# Altium schematic sheet micron_ram.SchDoc
size A; SheetNumber: 1; SheetTotal: 11
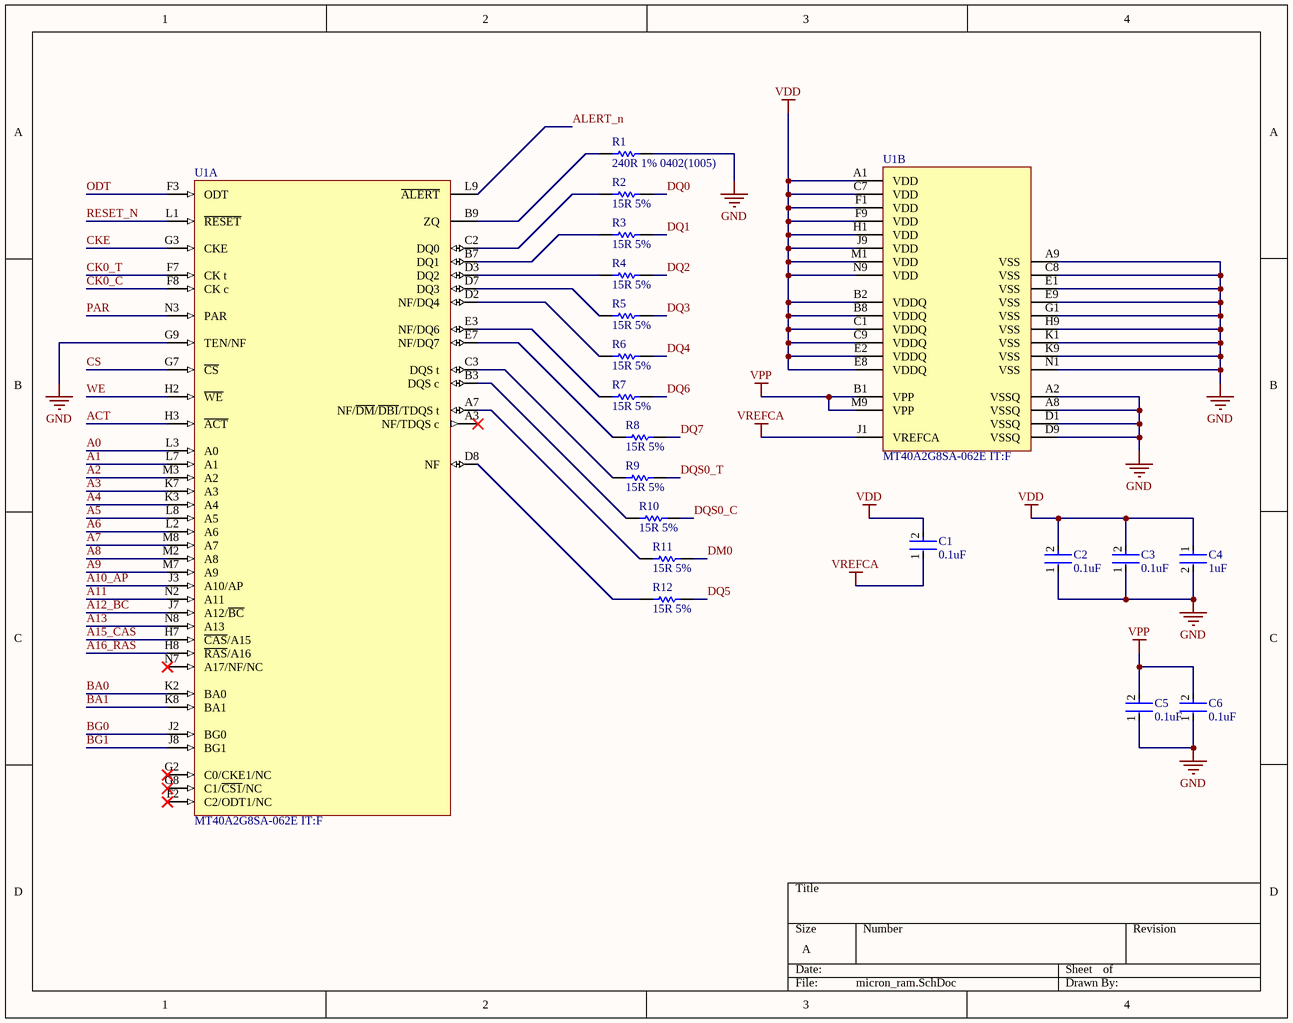
[diagram p0: micron_ram.SchDoc]

## Parts
C1  0.1uF  [FP-GRM15-MFG]
C2  0.1uF  [FP-GRM15-MFG]
C3  0.1uF  [FP-GRM15-MFG]
C4  1uF  [FP-CL511-IPC_C]
C5  0.1uF  [FP-GRM15-MFG]
C6  0.1uF  [FP-GRM15-MFG]
R1  240R 1% 0402(1005)  [RESC0402(1005)_L]
R2  15R 5%  [RESC1005X40X25LL05T10]
R3  15R 5%  [RESC1005X40X25LL05T10]
R4  15R 5%  [RESC1005X40X25LL05T10]
R5  15R 5%  [RESC1005X40X25LL05T10]
R6  15R 5%  [RESC1005X40X25LL05T10]
R7  15R 5%  [RESC1005X40X25LL05T10]
R8  15R 5%  [RESC1005X40X25LL05T10]
R9  15R 5%  [RESC1005X40X25LL05T10]
R10  15R 5%  [RESC1005X40X25LL05T10]
R11  15R 5%  [RESC1005X40X25LL05T10]
R12  15R 5%  [RESC1005X40X25LL05T10]
U1  MT40A2G8SA-062E IT:F  [SA_MFG]  (parts A,B of 2)

## Nets
GND: C2.1 C3.1 C4.2 C5.1 C6.1 R1.2 U1.A2(VSSQ) U1.A8(VSSQ) U1.A9(VSS) U1.C8(VSS) U1.D1(VSSQ) U1.D9(VSSQ) U1.E1(VSS) U1.E9(VSS) U1.G1(VSS) U1.G9(TEN/NF) U1.H9(VSS) U1.K1(VSS) U1.K9(VSS) U1.N1(VSS)
VDD: C1.2 C2.2 C3.2 C4.1 U1.A1(VDD) U1.B2(VDDQ) U1.B8(VDDQ) U1.C1(VDDQ) U1.C7(VDD) U1.C9(VDDQ) U1.E2(VDDQ) U1.E8(VDDQ) U1.F1(VDD) U1.F9(VDD) U1.H1(VDD) U1.J9(VDD) U1.M1(VDD) U1.N9(VDD)
VPP: C5.2 C6.2 U1.B1(VPP) U1.M9(VPP)
VREFCA: C1.1 U1.J1(VREFCA)
A0: U1.L3(A0)
A1: U1.L7(A1)
A2: U1.M3(A2)
A3: U1.K7(A3)
A4: U1.K3(A4)
A5: U1.L8(A5)
A6: U1.L2(A6)
A7: U1.M8(A7)
A8: U1.M2(A8)
A9: U1.M7(A9)
A10_AP: U1.J3(A10/AP)
A11: U1.N2(A11)
A12_BC: U1.J7(A12/~{BC})
A13: U1.N8(A13)
A15_CAS: U1.H7(~{CAS}/A15)
A16_RAS: U1.H8(~{RAS}/A16)
ACT: U1.H3(~{ACT})
ALERT_n: U1.L9(~{ALERT})
BA0: U1.K2(BA0)
BA1: U1.K8(BA1)
BG0: U1.J2(BG0)
BG1: U1.J8(BG1)
CK0_C: U1.F8(CK_c)
CK0_T: U1.F7(CK_t)
CKE: U1.G3(CKE)
CS: U1.G7(~{CS})
DM0: R11.2
DQ0: R2.2
DQ1: R3.2
DQ2: R4.2
DQ3: R5.2
DQ4: R6.2
DQ5: R12.2
DQ6: R7.2
DQ7: R8.2
DQS0_C: R10.2
DQS0_T: R9.2
ODT: U1.F3(ODT)
PAR: U1.N3(PAR)
RESET_N: U1.L1(~{RESET})
WE: U1.H2(~{WE})
NetR1_1: R1.1 U1.B9(ZQ)
NetR2_1: R2.1 U1.C2(DQ0)
NetR3_1: R3.1 U1.B7(DQ1)
NetR4_1: R4.1 U1.D3(DQ2)
NetR5_1: R5.1 U1.D7(DQ3)
NetR6_1: R6.1 U1.D2(NF/DQ4)
NetR7_1: R7.1 U1.E3(NF/DQ6)
NetR8_1: R8.1 U1.E7(NF/DQ7)
NetR9_1: R9.1 U1.C3(DQS_t)
NetR10_1: R10.1 U1.B3(DQS_c)
NetR11_1: R11.1 U1.A7(NF/~{DM}/~{DBI}/TDQS_t)
NetR12_1: R12.1 U1.D8(NF)

Not connected (* = marked no-connect by the designer): U1 A3(NF/TDQS_c)* F2(C2/ODT1/NC)* G2(C0/CKE1/NC)* G8(C1/~{CS1}/NC)* N7(A17/NF/NC)*

## Library data of the parts
C1-C3 C5 C6 = CMP-2100-03641-2: CAP CER 0.1UF 16V X7R 0402; Manufacturer Part Number: GRM155R71C104KA88D; Manufacturer: Murata; Standoff Height: 0mm; Tolerance: 10%; Voltage Rating: 16Vdc; Material: Ceramic; Capacitance: 0.10μF; Value: 0.10μF; RoHS: TRUE; Temperature Characteristic: X7R; Octopart: https://octopart.com/grm155r71c104ka88d-murata-196880; Digikey Description: CAP CER 0.1UF 16V X7R 0402; Device Class L3: Ceramic Capacitors; Height: 0.55mm; ComponentLink2Description: Datasheet; Temperature Range Low: -55°C; Ipc Land Pattern Name: CAPC10050X219; ComponentLink2URL: https://search.murata.co.jp/Ceramy/image/img/A01X/G101/ENG/GRM155R71H471KA01-01A.pdf; Device Class L1: Passive Components; Lead Free: yes; Category: Cap; Package: GRM15; Temperature: -55°C to +125°C; Device Class L2: Capacitors; Temperature Range High: +125°C; Mouser Description: 0402 0.1 uF 16V ±10 % Tolerance X7R SMT Multilayer Ceramic Capacitor
C4 = CMP-13271-001936-1: Cap Ceramic 1uF 10V X5R ±10% SMD 0402 +85°C Paper T/R; Depth: 0.5mm; Case Code (Imperial): 0402; Material: Ceramic; Mount: Surface Mount; Thickness: 0.022inch; Dielectric: X5R; Capacitance: 1uF; Radiation Hardening: No; Case/Package: 0402; Length: 1mm; Tolerance: 10%; Max Operating Temperature: 85°C; Package Quantity: 1; Width: 0.02inch; Voltage Rating: 10V; Contact Plating: Tin; Height: 0.5mm; Min Operating Temperature: -55°C; Case Code (Metric): 1005; Packaging: Tape and Reel
R1 = CMP-1011-00438-1: 240R 0.063W 1% 0402 (1005 Metric)  SMD; Case-Metric: 1005; Case-EIA: 0402; Value: 240.00 Ohm; Power: 0.063 W; Tolerance: 1 %; Technology: SMT
R2-R12 = CMP-2002-07413-1: Manufacturer: Yageo / Phycomp; Part Number: RC0402FR-0715RL
U1 = CMP-00526-125391410-1: DRAMChip DDR4 SDRAM 16Gbit 2Gx8 1.2V 78-Pin FBGA Tray; ComponentLink1URL: http://www.micron.com/; ComponentLink3Description: Manufacturer's Package Drawing; ComponentLink2Description: Datasheet URL; ComponentLink1Description: Manufacturer's Website; ComponentLink3URL: https://www.micron.com/content/dam/micron/global/public/products/customer-service-note/csn33-bga-user-guide.pdf; HelpURL: https://4donline.ihs.com/images/VipMasterIC/IC/MICT/MICT-S-A0014105731/MICT-S-A0014105731-1.pdf?hkey=6D3A4C79FDBF58556ACFDE234799DDF0; ComponentLink2URL: https://4donline.ihs.com/images/VipMasterIC/IC/MICT/MICT-S-A0014105731/MICT-S-A0014105731-1.pdf?hkey=6D3A4C79FDBF58556ACFDE234799DDF0